# EAGLE design Double (EAGLE 9.5.2)
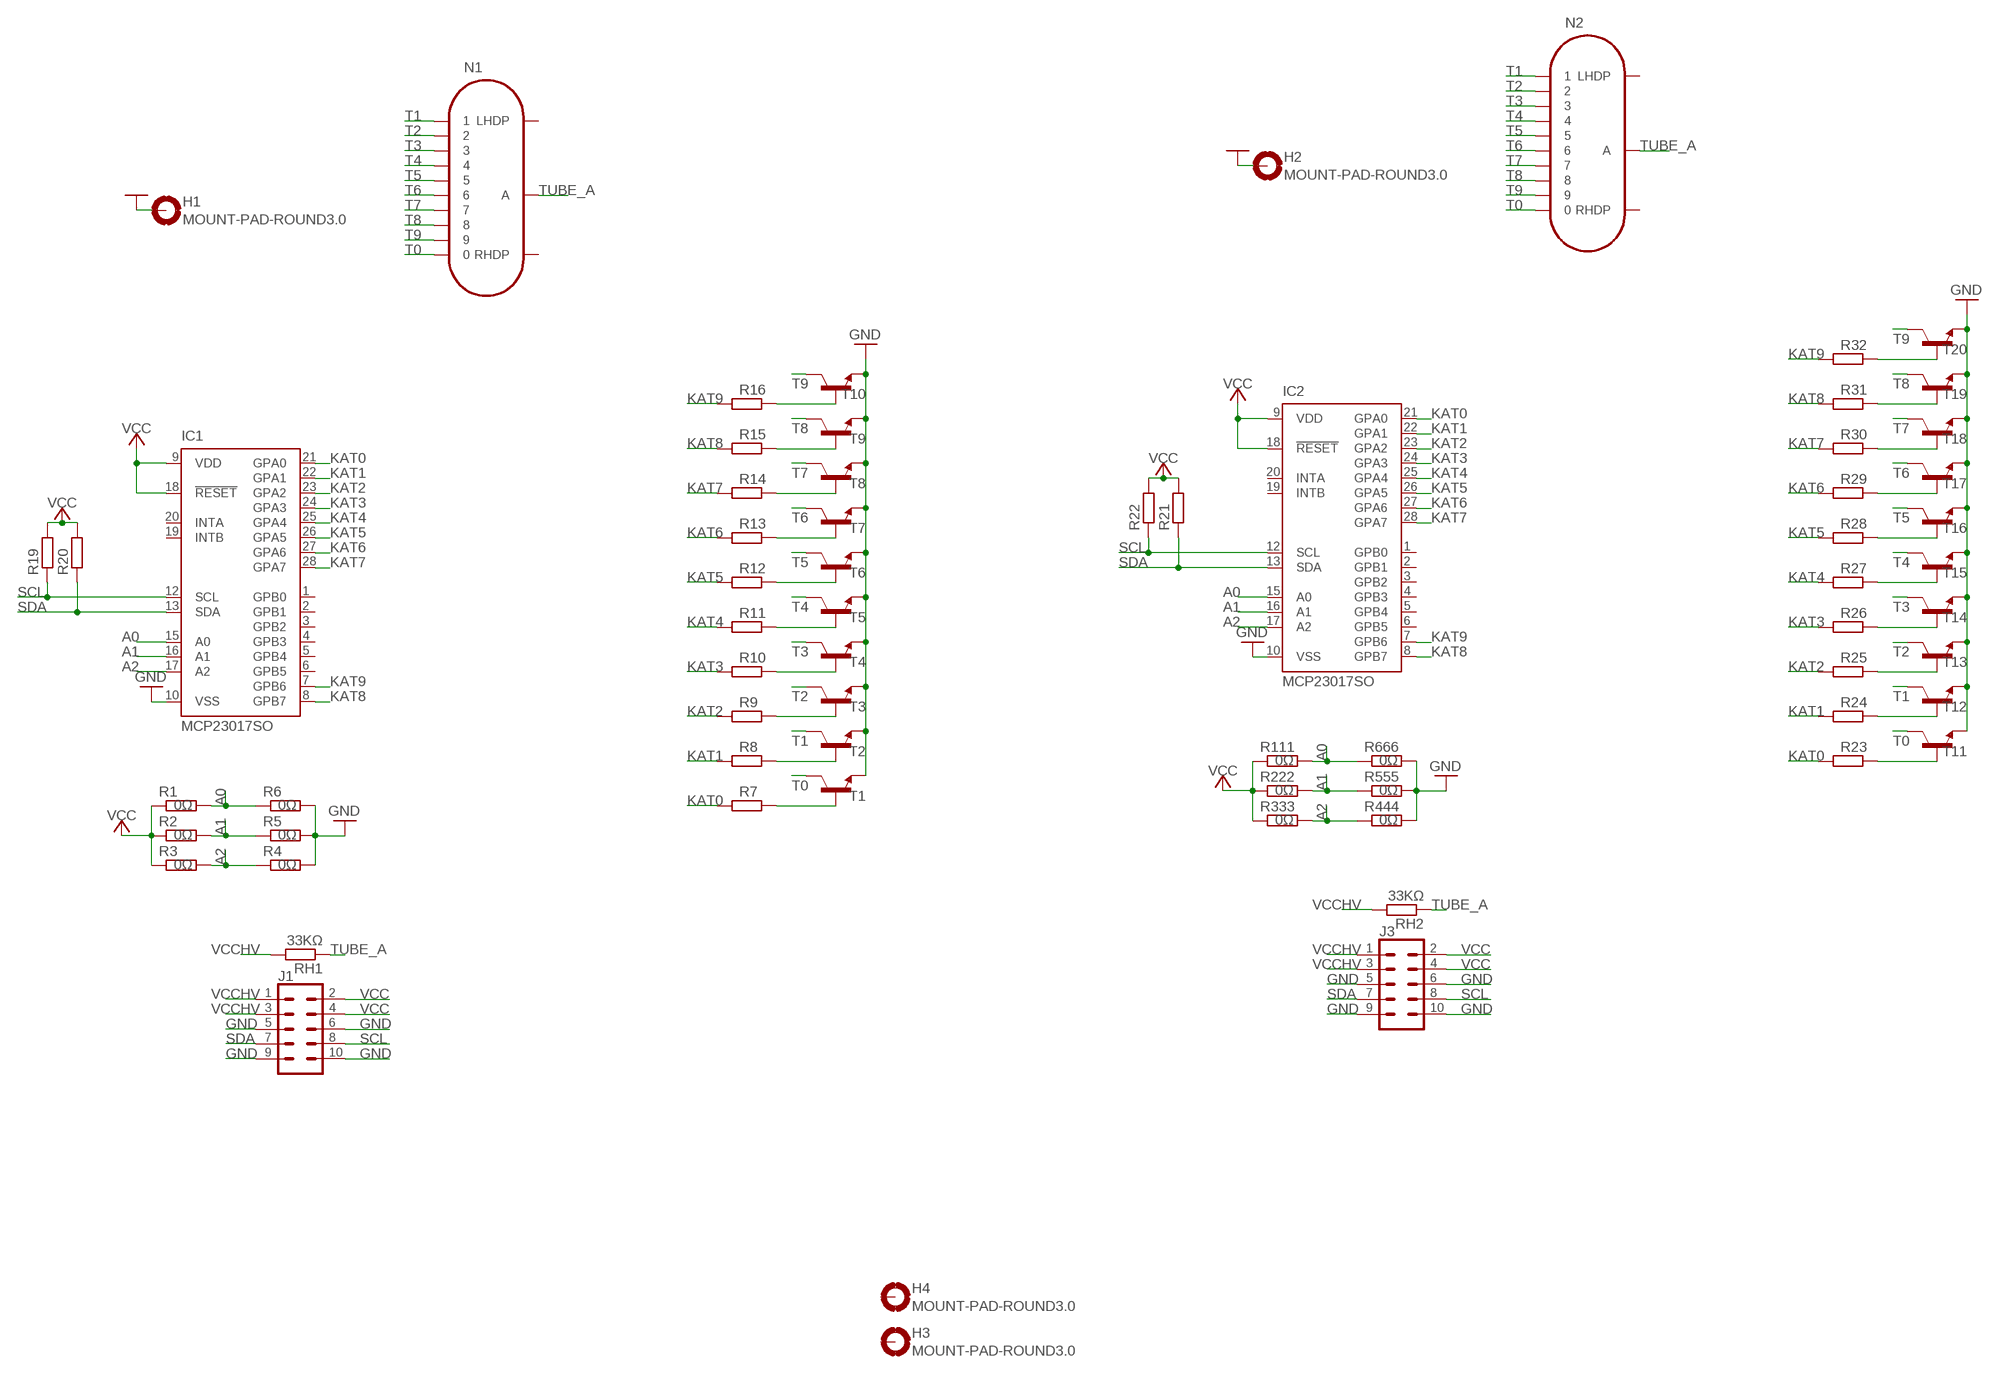
[diagram p0: schematic, sheet 1]

## Parts
H1  MOUNT-PAD-ROUND3.0  [3,0-PAD]
H2  MOUNT-PAD-ROUND3.0  [3,0-PAD]
H3  MOUNT-PAD-ROUND3.0  [3,0-PAD]
H4  MOUNT-PAD-ROUND3.0  [3,0-PAD]
IC1  MCP23017SO  [SO28W]
IC2  MCP23017SO  [SO28W]
J1  CONN_05X2PTH  [2X5]
J3  CONN_05X2PTH  [2X5]
N1  IN-14  [IN-14]
N2  IN-14  [IN-14]
R1  0Ω  R-EU_R1206  [R1206]
R2  0Ω  R-EU_R1206  [R1206]
R3  0Ω  R-EU_R1206  [R1206]
R4  0Ω  R-EU_R1206  [R1206]
R5  0Ω  R-EU_R1206  [R1206]
R6  0Ω  R-EU_R1206  [R1206]
R7  R-EU_R1206  [R1206]
R8  R-EU_R1206  [R1206]
R9  R-EU_R1206  [R1206]
R10  R-EU_R1206  [R1206]
R11  R-EU_R1206  [R1206]
R12  R-EU_R1206  [R1206]
R13  R-EU_R1206  [R1206]
R14  R-EU_R1206  [R1206]
R15  R-EU_R1206  [R1206]
R16  R-EU_R1206  [R1206]
R19  R-EU_R1206  [R1206]
R20  R-EU_R1206  [R1206]
R21  R-EU_R1206  [R1206]
R22  R-EU_R1206  [R1206]
R23  R-EU_R1206  [R1206]
R24  R-EU_R1206  [R1206]
R25  R-EU_R1206  [R1206]
R26  R-EU_R1206  [R1206]
R27  R-EU_R1206  [R1206]
R28  R-EU_R1206  [R1206]
R29  R-EU_R1206  [R1206]
R30  R-EU_R1206  [R1206]
R31  R-EU_R1206  [R1206]
R32  R-EU_R1206  [R1206]
R111  0Ω  R-EU_R1206  [R1206]
R222  0Ω  R-EU_R1206  [R1206]
R333  0Ω  R-EU_R1206  [R1206]
R444  0Ω  R-EU_R1206  [R1206]
R555  0Ω  R-EU_R1206  [R1206]
R666  0Ω  R-EU_R1206  [R1206]
RH1  33KΩ  R-EU_0207/15  [0207/15]
RH2  33KΩ  R-EU_0207/15  [0207/15]
T1  MMBTA42LT1-NPN-SOT23-BEC  [SOT23-BEC]
T2  MMBTA42LT1-NPN-SOT23-BEC  [SOT23-BEC]
T3  MMBTA42LT1-NPN-SOT23-BEC  [SOT23-BEC]
T4  MMBTA42LT1-NPN-SOT23-BEC  [SOT23-BEC]
T5  MMBTA42LT1-NPN-SOT23-BEC  [SOT23-BEC]
T6  MMBTA42LT1-NPN-SOT23-BEC  [SOT23-BEC]
T7  MMBTA42LT1-NPN-SOT23-BEC  [SOT23-BEC]
T8  MMBTA42LT1-NPN-SOT23-BEC  [SOT23-BEC]
T9  MMBTA42LT1-NPN-SOT23-BEC  [SOT23-BEC]
T10  MMBTA42LT1-NPN-SOT23-BEC  [SOT23-BEC]
T11  MMBTA42LT1-NPN-SOT23-BEC  [SOT23-BEC]
T12  MMBTA42LT1-NPN-SOT23-BEC  [SOT23-BEC]
T13  MMBTA42LT1-NPN-SOT23-BEC  [SOT23-BEC]
T14  MMBTA42LT1-NPN-SOT23-BEC  [SOT23-BEC]
T15  MMBTA42LT1-NPN-SOT23-BEC  [SOT23-BEC]
T16  MMBTA42LT1-NPN-SOT23-BEC  [SOT23-BEC]
T17  MMBTA42LT1-NPN-SOT23-BEC  [SOT23-BEC]
T18  MMBTA42LT1-NPN-SOT23-BEC  [SOT23-BEC]
T19  MMBTA42LT1-NPN-SOT23-BEC  [SOT23-BEC]
T20  MMBTA42LT1-NPN-SOT23-BEC  [SOT23-BEC]

## Nets
A0: IC1.15(A0) IC2.15(A0) R1.2 R6.1 R111.2 R666.1
A1: IC1.16(A1) IC2.16(A1) R2.2 R5.1 R222.2 R555.1
A2: IC1.17(A2) IC2.17(A2) R3.2 R4.1 R333.2 R444.1
GND: H1.B3,0(MOUNT) H2.B3,0(MOUNT) IC1.10(VSS) IC2.10(VSS) J1.5 J1.6 J1.9 J1.10 J3.5 J3.6 J3.9 J3.10 R4.2 R5.2 R6.2 R444.2 R555.2 R666.2 T1.E T2.E T3.E T4.E T5.E T6.E T7.E T8.E T9.E T10.E T11.E T12.E T13.E T14.E T15.E T16.E T17.E T18.E T19.E T20.E
KAT0: IC1.21(GPA0) IC2.21(GPA0) R7.1 R23.1
KAT1: IC1.22(GPA1) IC2.22(GPA1) R8.1 R24.1
KAT2: IC1.23(GPA2) IC2.23(GPA2) R9.1 R25.1
KAT3: IC1.24(GPA3) IC2.24(GPA3) R10.1 R26.1
KAT4: IC1.25(GPA4) IC2.25(GPA4) R11.1 R27.1
KAT5: IC1.26(GPA5) IC2.26(GPA5) R12.1 R28.1
KAT6: IC1.27(GPA6) IC2.27(GPA6) R13.1 R29.1
KAT7: IC1.28(GPA7) IC2.28(GPA7) R14.1 R30.1
KAT8: IC1.8(GPB7) IC2.8(GPB7) R15.1 R31.1
KAT9: IC1.7(GPB6) IC2.7(GPB6) R16.1 R32.1
N$2: R7.2 T1.B
N$3: R16.2 T10.B
N$4: R15.2 T9.B
N$5: R14.2 T8.B
N$6: R13.2 T7.B
N$7: R12.2 T6.B
N$8: R11.2 T5.B
N$9: R10.2 T4.B
N$10: R9.2 T3.B
N$11: R8.2 T2.B
N$21: R23.2 T11.B
N$22: R32.2 T20.B
N$23: R31.2 T19.B
N$24: R30.2 T18.B
N$25: R29.2 T17.B
N$26: R28.2 T16.B
N$27: R27.2 T15.B
N$28: R26.2 T14.B
N$29: R25.2 T13.B
N$30: R24.2 T12.B
SCL: IC1.12(SCL) IC2.12(SCL) J1.8 J3.8 R19.1 R22.1
SDA: IC1.13(SDA) IC2.13(SDA) J1.7 J3.7 R20.1 R21.1
T0: N1.0 N2.0 T1.C T11.C
T1: N1.1 N2.1 T2.C T12.C
T2: N1.2 N2.2 T3.C T13.C
T3: N1.3 N2.3 T4.C T14.C
T4: N1.4 N2.4 T5.C T15.C
T5: N1.5 N2.5 T6.C T16.C
T6: N1.6 N2.6 T7.C T17.C
T7: N1.7 N2.7 T8.C T18.C
T8: N1.8 N2.8 T9.C T19.C
T9: N1.9 N2.9 T10.C T20.C
TUBE_A: N1.A N2.A RH1.1 RH2.1
VCC: IC1.9(VDD) IC1.18(!RESET) IC2.9(VDD) IC2.18(!RESET) J1.2 J1.4 J3.2 J3.4 R1.1 R2.1 R3.1 R19.2 R20.2 R21.2 R22.2 R111.1 R222.1 R333.1
VCCHV: J1.1 J1.3 J3.1 J3.3 RH1.2 RH2.2
Unconnected: H3.B3,0(MOUNT) H4.B3,0(MOUNT) IC1.1(GPB0) IC1.2(GPB1) IC1.3(GPB2) IC1.4(GPB3) IC1.5(GPB4) IC1.6(GPB5) IC1.19(INTB) IC1.20(INTA) IC2.1(GPB0) IC2.2(GPB1) IC2.3(GPB2) IC2.4(GPB3) IC2.5(GPB4) IC2.6(GPB5) IC2.19(INTB) IC2.20(INTA) N1.LHDP N1.RHDP N2.LHDP N2.RHDP

## Library data of the parts
H1-H4 = holes:MOUNT-PAD-ROUND: MOUNTING PAD, round
IC1 IC2 = adafruit:MCP23017: http://ww1.microchip.com/downloads/en/DeviceDoc/21952a.pdf Source: http://ww1.microchip.com/downloads/en/DeviceDoc/21952a.pdf
J1 J3 = SparkFun-Connectors:CONN_05X2: Multi connection point. Often used as Generic Header-pin footprint for 0.1 inch spaced/style header connections For AVR SPI programming port, see special device with nice symbol: "AVR_SPI_PROG_5x2.dev" You can populate with any combo of single row headers, but if you'd like an exact match, check these: 2x5 AVR ICSP Male Header <https://www.sparkfun.com/products/778> (PRT-00778) 2x5 Pin Shrouded Header <https://www.sparkfun.com/products/8506> (PRT-08506) On any of the 0.1 inch spaced packages, you can populate with these: Break Away Headers - Straight <https://www.sparkfun.com/products/116> (PRT-00116) Break Away Male Headers - Right Angle <https://www.sparkfun.com/products/553> (PRT-00553) Female Headers <https://www.sparkfun.com/products/115> (PRT-00115) Break Away Headers - Machine Pin <https://www.sparkfun.com/products/117> (PRT-00117) Break Away Female Headers - Swiss Machine Pin <https://www.sparkfun.com/products/743> (PRT-00743) Special note: the shrouded connector mates well with our 5x2 ribbon cables: 2x5 Pin IDC Ribbon Cable <https://www.sparkfun.com/products/8535> (PRT-08535); PROD_ID: CONN-08499; SF_ID: PRT-0778
N1 N2 = russian-nixies:IN-14: IN-14: medium numeric frontview nixie tube
R1-R16 R19-R32 R111 R222 R333 R444 R555 R666 RH1 RH2 = resistor:R-EU_: RESISTOR, European symbol
T1-T20 = transistor:*-NPN-: NPN Transistror BF959 corrected 2008.03.06

## Board
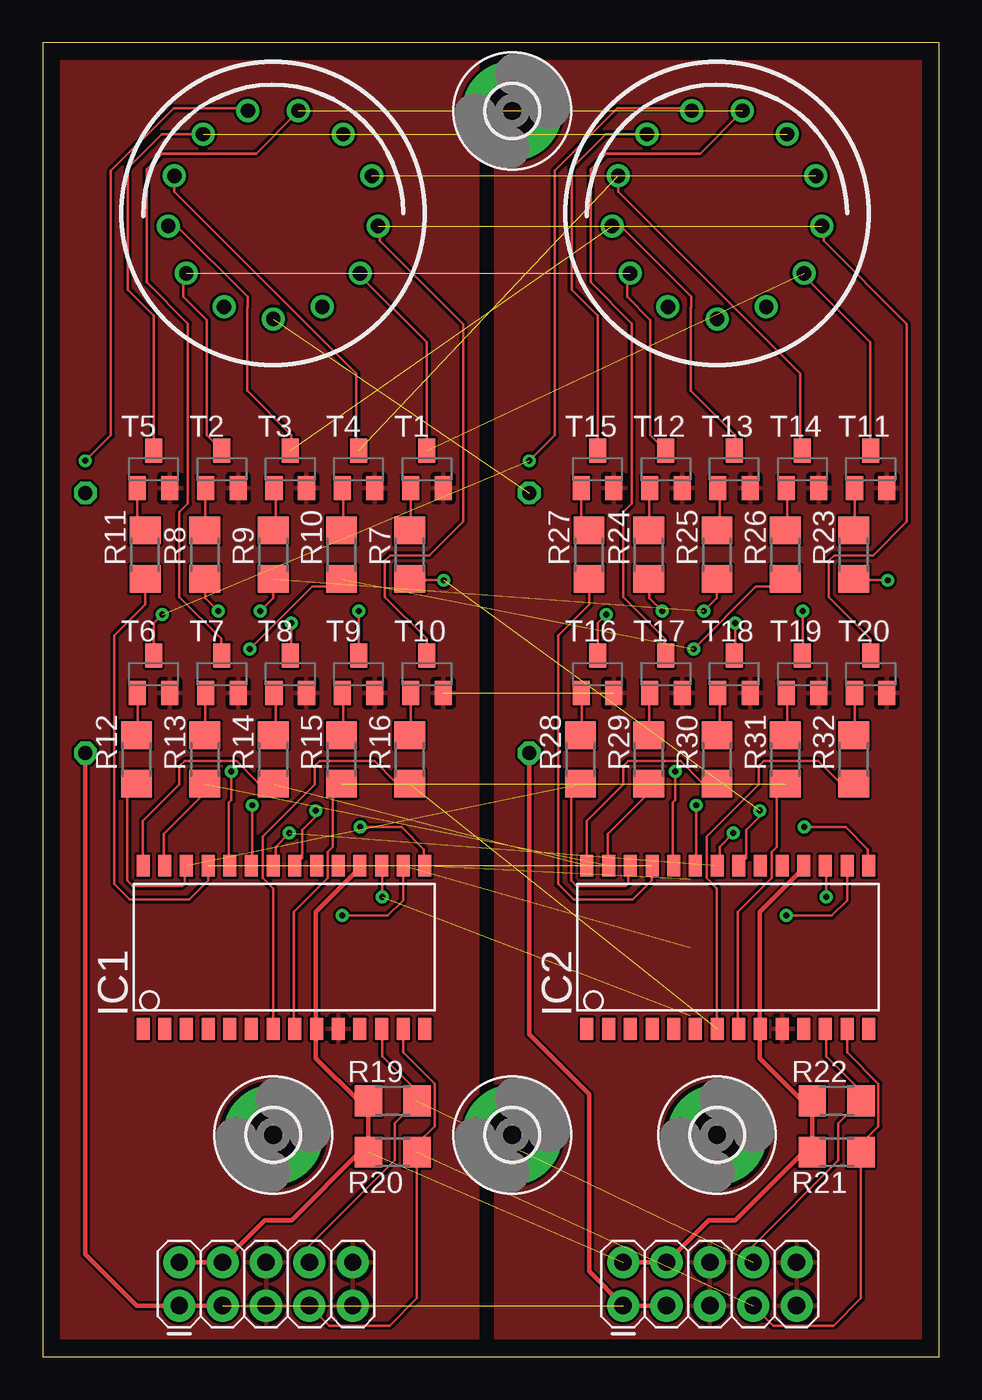
[diagram p1: board, top side]
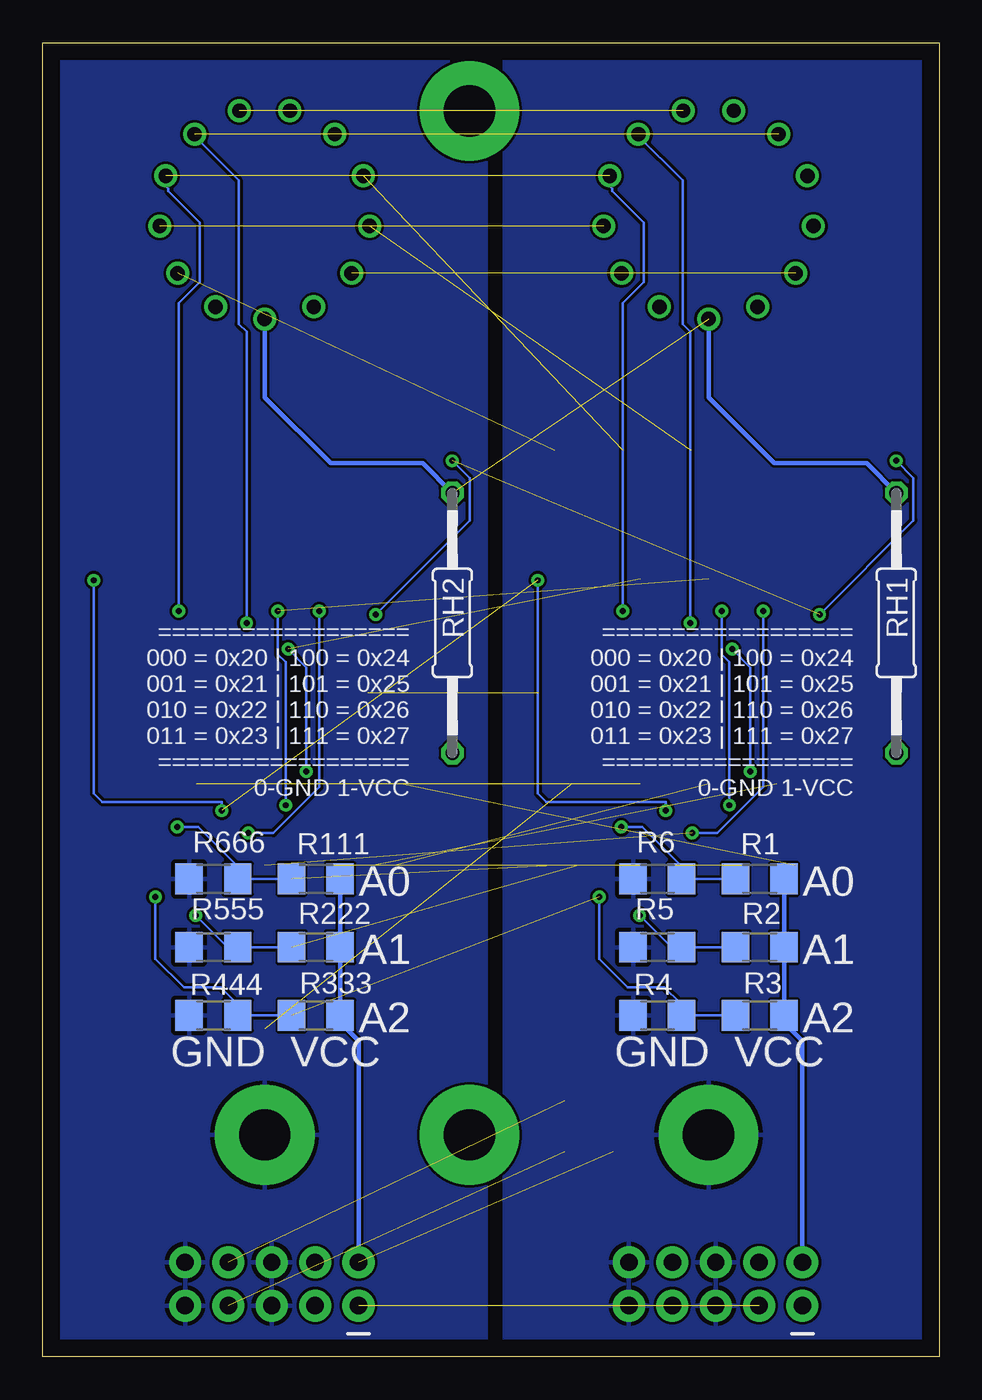
[diagram p2: board, bottom side, seen from below]

Size 52.5 x 77 mm. Coordinates in mm from the lower left corner, seen from the top.
Outline: 0,77 0,0 52.5,0 52.5,77 0,77
Copper layers (1*16): Top 0.035mm / dielectric 1.5mm / Bottom 0.035mm
Design rules "default": minimum track width 6mil, minimum drill 0.35mm, track to track 6mil, track to pad 6mil, pad to pad 6mil, via to via 6mil, smd to smd 6mil, copper to edge 40mil, drill to drill 6mil, minimum pad ring 10mil, minimum via ring 8mil, stop-mask expansion 4mil, vias tented up to drill 0mil, thermal gap 10mil

### Footprints (pad centres in the part's own frame; a part is rotated, then mirrored left to right if it is on the bottom)
3,0-PAD = drill 3 pad 5.842: B3,0 0,0
SO28W = smd 0.762 x 1.27: 1 -7.62,-4.78; 2 -6.35,-4.78; 3 -5.08,-4.78; 4 -3.81,-4.78; 5 -2.54,-4.78; 6 -1.27,-4.78; 7 0,-4.78; 8 1.27,-4.78; 9 2.54,-4.78; 10 3.81,-4.78; 11 5.08,-4.78; 12 6.35,-4.78; 13 7.62,-4.78; 14 8.89,-4.78; 15 8.89,4.78; 16 7.62,4.78; 17 6.35,4.78; 18 5.08,4.78; 19 3.81,4.78; 20 2.54,4.78; 21 1.27,4.78; 22 0,4.78; 23 -1.27,4.78; 24 -2.54,4.78; 25 -3.81,4.78; 26 -5.08,4.78; 27 -6.35,4.78; 28 -7.62,4.78
2X5 = drill 1.016 pad 1.88: 1 0,0; 2 0,2.54; 3 2.54,0; 4 2.54,2.54; 5 5.08,0; 6 5.08,2.54; 7 7.62,0; 8 7.62,2.54; 9 10.16,0; 10 10.16,2.54
IN-14 = drill 0.84: 0 5.094,-3.516; 1 -5.094,-3.516; 2 -6.145,-0.746; 3 -5.788,2.195; 4 -4.105,4.633; 5 -1.481,6.01; 6 1.481,6.01; 7 4.105,4.633; 8 5.788,2.195; 9 6.145,-0.746; A 0,-6.19; LHDP 2.877,-5.481; RHDP -2.877,-5.481
R1206 = smd 1.6 x 1.803: 1 -1.422,0; 2 1.422,0
0207/15 = drill 0.813 octagon: 1 -7.62,0; 2 7.62,0
SOT23-BEC = smd 1 x 1.4: B -0.95,-1.1; C 0,1.1; E 0.95,-1.1

### Placement (x,y rotation side)
H1  13.5,13 0 top
H2  39.5,13 0 top
H3  27.5,73 0 top
H4  27.5,13 0 top
IC1  13.5,24 0 top
IC2  39.5,24 0 top
J1  8,3 0 top
J3  34,3 0 top
N1  13.5,67 0 top
N2  39.5,67 0 top
R1  10.5,28 180 bottom
R2  10.5,24 180 bottom
R3  10.5,20 180 bottom
R4  16.5,20 180 bottom
R5  16.5,24 180 bottom
R6  16.5,28 180 bottom
R7  21.5,47 90 top
R8  9.5,47 90 top
R9  13.5,47 90 top
R10  17.5,47 90 top
R11  6,47 90 top
R12  5.5,35 90 top
R13  9.5,35 90 top
R14  13.5,35 90 top
R15  17.5,35 90 top
R16  21.5,35 90 top
R19  20.5,15 180 top
R20  20.5,12 180 top
R21  46.5,12 180 top
R22  46.5,15 180 top
R23  47.5,47 90 top
R24  35.5,47 90 top
R25  39.5,47 90 top
R26  43.5,47 90 top
R27  32,47 90 top
R28  31.5,35 90 top
R29  35.5,35 90 top
R30  39.5,35 90 top
R31  43.5,35 90 top
R32  47.5,35 90 top
R111  36.5,28 180 bottom
R222  36.5,24 180 bottom
R333  36.5,20 180 bottom
R444  42.5,20 180 bottom
R555  42.5,24 180 bottom
R666  42.5,28 180 bottom
RH1  2.5,43 270 bottom
RH2  28.5,43 270 bottom
T1  22.5,52 0 top
T2  10.5,52 0 top
T3  14.5,52 0 top
T4  18.5,52 0 top
T5  6.5,52 0 top
T6  6.5,40 0 top
T7  10.5,40 0 top
T8  14.5,40 0 top
T9  18.5,40 0 top
T10  22.5,40 0 top
T11  48.5,52 0 top
T12  36.5,52 0 top
T13  40.5,52 0 top
T14  44.5,52 0 top
T15  32.5,52 0 top
T16  32.5,40 0 top
T17  36.5,40 0 top
T18  40.5,40 0 top
T19  44.5,40 0 top
T20  48.5,40 0 top

### Tracks (layer width: path | path; a pad name or v marks a point on that pad's centre or on a via)
A0  (via drill 0.35)  (1 unrouted)
  Top 0.152: v18.61,31.03 21.03,31.03 22.33,29.73 22.33,28.82 IC1.15 | v44.61,31.03 47.03,31.03 48.33,29.73 48.33,28.82 IC2.15
  Bottom 0.152: R1.2 R6.1 15.17,28.05 15.17,28.82 17.39,31.03 v18.61,31.03 | R111.2 R666.1 41.17,28.05 41.17,28.82 43.39,31.03 v44.61,31.03
A1  (via drill 0.35)  (1 unrouted)
  Top 0.152: v17.54,25.85 20.22,25.85 21.11,26.75 21.11,28.66 IC1.16 | v43.54,25.85 46.22,25.85 47.11,26.75 47.11,28.66 IC2.16
  Bottom 0.152: 11.97,24 R5.1 15.17,24.09 15.78,24.09 v17.54,25.85 | 11.97,24 R2.2 11.97,23.94 11.97,24 | 37.97,24 R555.1 41.17,24.09 41.78,24.09 v43.54,25.85 | 37.97,24 R222.2 37.97,23.94 37.97,24
A2  (via drill 0.35)  (1 unrouted)
  Top 0.152: v19.89,26.94 19.89,28.66 IC1.17 | v45.89,26.94 45.89,28.66 IC2.17
  Bottom 0.152: R3.2 R4.1 15.17,20.13 15.17,20.74 16.08,21.65 18.22,21.65 19.89,23.33 v19.89,26.94 | R333.2 R444.1 41.17,20.13 41.17,20.74 42.08,21.65 44.22,21.65 45.89,23.33 v45.89,26.94
GND  (1 unrouted)
  Top 0.152: 19.89,50.91 19.59,50.91 | 45.89,50.91 45.59,50.91
  pour Bottom: 0,77 0,0 25.5,0 25.5,77
  pour Top: 0,77 0,0 25.5,0 25.5,77
  pour Bottom: 26.5,77 26.5,0 52.5,0 52.5,77
  pour Top: 26.5,77 26.5,0 52.5,0 52.5,77
KAT0  (via drill 0.35)  (1 unrouted)
  Top 0.152: IC1.21 15.21,29.22 15.21,30.86 16,31.65 v16,32 | v23.5,45.5 21.58,45.5 R7.1 | IC2.21 41.21,29.22 41.21,30.86 42,31.65 v42,32 | v49.5,45.5 47.58,45.5 R23.1
  Bottom 0.152: v23.5,45.5 23.5,33 23,32.5 16,32.5 v16,32 | v49.5,45.5 49.5,33 49,32.5 42,32.5 v42,32
KAT1  (via drill 0.35)  (1 unrouted)
  Top 0.152: v14.45,30.69 13.65,29.88 13.65,28.82 IC1.22 | v10.29,43.71 9.53,44.47 9.53,45.43 R8.1 | v40.45,30.69 39.65,29.88 39.65,28.82 IC2.22 | v36.29,43.71 35.53,44.47 35.53,45.43 R24.1
  Bottom 0.152: v14.45,30.69 12.99,30.69 10.29,33.39 v10.29,43.71 | v40.45,30.69 38.99,30.69 36.29,33.39 v36.29,43.71
KAT2  (via drill 0.35)  (1 unrouted)
  Top 0.152: v12.27,32.32 12.27,28.82 IC1.23 | v12.73,43.71 13.49,44.47 13.49,45.43 R9.1 | v38.27,32.32 38.27,28.82 IC2.23 | v38.73,43.71 39.49,44.47 39.49,45.43 R25.1
  Bottom 0.152: v12.27,32.32 12.27,40.7 12.73,41.16 v12.73,43.71 | v38.27,32.32 38.27,40.7 38.73,41.16 v38.73,43.71
KAT3  (via drill 0.35)  (1 unrouted)
  Top 0.152: v11.05,34.3 11.05,32.63 10.9,32.47 10.9,28.82 IC1.24 | v12.12,41.47 15.78,45.12 17.15,45.12 17.46,45.43 R10.1 | v37.05,34.3 37.05,32.63 36.9,32.47 36.9,28.82 IC2.24 | v38.12,41.47 41.78,45.12 43.15,45.12 43.46,45.43 R26.1
  Bottom 0.152: v11.05,34.3 11.05,40.4 v12.12,41.47 | v37.05,34.3 37.05,40.4 v38.12,41.47
KAT4  (1 unrouted)
  Top 0.152: R11.1 6,44.08 4.2,42.28 4.2,27.71 5.11,26.79 8.57,26.79 9.68,27.9 9.68,28.66 IC1.25 | R27.1 32,44.08 30.2,42.28 30.2,27.71 31.11,26.79 34.57,26.79 35.68,27.9 35.68,28.66 IC2.25
KAT5  (1 unrouted)
  Top 0.152: IC1.26 8.31,28.66 8.31,27.75 8.16,27.6 5.26,27.6 4.96,27.9 4.96,33.08 5.42,33.54 R12.1 | IC2.26 34.31,28.66 34.31,27.75 34.16,27.6 31.26,27.6 30.96,27.9 30.96,33.08 31.42,33.54 R28.1
KAT6  (1 unrouted)
  Top 0.152: IC1.27 7.09,28.82 7.09,30.65 9.38,32.93 9.38,33.54 R13.1 | IC2.27 33.09,28.82 33.09,30.65 35.38,32.93 35.38,33.54 R29.1
KAT7  (1 unrouted)
  Top 0.152: IC1.28 5.87,28.82 5.87,31.41 8.01,33.54 8.01,34.61 8.31,34.91 11.36,34.91 12.58,33.69 13.49,33.69 R14.1 | IC2.28 31.87,28.82 31.87,31.41 34.01,33.54 34.01,34.61 34.31,34.91 37.36,34.91 38.58,33.69 39.49,33.69 R30.1
KAT8  (1 unrouted)
  Top 0.152: IC1.8 14.71,19.37 14.71,26.07 16.69,28.05 16.69,29.58 17,29.88 17,33.08 17.46,33.54 R15.1 | IC2.8 40.71,19.37 40.71,26.07 42.69,28.05 42.69,29.58 43,29.88 43,33.08 43.46,33.54 R31.1
KAT9  (1 unrouted)
  Top 0.152: IC1.7 13.49,19.37 13.49,27.44 12.88,28.05 12.88,30.49 15.93,33.54 15.93,34.61 16.24,34.91 19.44,34.91 20.66,33.69 21.42,33.69 R16.1 | IC2.7 39.49,19.37 39.49,27.44 38.88,28.05 38.88,30.49 41.93,33.54 41.93,34.61 42.24,34.91 45.44,34.91 46.66,33.69 47.42,33.69 R32.1
N$2
  Top 0.152: T1.B 21.57,50.76 21.57,48.48 R7.2
N$3
  Top 0.152: T10.B 21.57,38.87 21.57,36.44 R16.2
N$4
  Top 0.152: T9.B 17.61,38.87 17.61,36.44 R15.2
N$5
  Top 0.152: T8.B 13.65,38.87 13.65,36.44 R14.2
N$6
  Top 0.152: T7.B 9.53,38.87 9.53,36.44 R13.2
N$7
  Top 0.152: T6.B 5.57,38.87 5.57,36.44 R12.2
N$8
  Top 0.152: T5.B 5.55,48.56 R11.2
N$9
  Top 0.152: T4.B 17.61,50.76 17.61,48.48 R10.2
N$10
  Top 0.152: T3.B 13.65,50.76 13.65,48.48 R9.2
N$11
  Top 0.152: T2.B 9.53,50.76 9.53,48.48 R8.2
N$21
  Top 0.152: T11.B 47.57,50.76 47.57,48.48 R23.2
N$22
  Top 0.152: T20.B 47.57,38.87 47.57,36.44 R32.2
N$23
  Top 0.152: T19.B 43.61,38.87 43.61,36.44 R31.2
N$24
  Top 0.152: T18.B 39.65,38.87 39.65,36.44 R30.2
N$25
  Top 0.152: T17.B 35.53,38.87 35.53,36.44 R29.2
N$26
  Top 0.152: T16.B 31.57,38.87 31.57,36.44 R28.2
N$27
  Top 0.152: T15.B 31.55,48.56 R27.2
N$28
  Top 0.152: T14.B 43.61,50.76 43.61,48.48 R26.2
N$29
  Top 0.152: T13.B 39.65,50.76 39.65,48.48 R25.2
N$30
  Top 0.152: T12.B 35.53,50.76 35.53,48.48 R24.2
SCL  (1 unrouted)
  Top 0.152: IC1.12 19.89,19.22 19.89,17.61 21.92,15.58 R19.1 20.61,13.69 20.61,11.5 15.62,6.52 J1.8 | IC2.12 45.89,19.22 45.89,17.61 47.92,15.58 R22.1 46.61,13.69 46.61,11.5 41.62,6.52 J3.8
SDA  (1 unrouted)
  Top 0.152: J1.7 16.79,1.83 20.33,1.83 21.92,3.42 R20.1 21.92,12.48 22.95,13.5 22.95,16 21.12,17.83 IC1.13 | J3.7 42.79,1.83 46.33,1.83 47.92,3.42 R21.1 47.92,12.48 48.95,13.5 48.95,16 47.12,17.83 IC2.13
T0  (1 unrouted)
  Top 0.152: T1.C 22.48,53.2 22.48,59.45 18.52,63.41 N1.0 | T11.C 48.48,53.2 48.48,59.45 44.52,63.41 N2.0
T1  (1 unrouted)
  Top 0.152: T2.C 9.6,54 9.6,60.75 8.23,62.12 8.23,63.3 N1.1 | T12.C 35.6,54 35.6,60.75 34.23,62.12 34.23,63.3 N2.1
T2  (1 unrouted)
  Top 0.152: T3.C 14.56,53.2 14.56,54.01 11.97,56.6 11.97,61.47 12,61.5 12,62.11 7.86,66.25 N1.2 | T13.C 40.56,53.2 40.56,54.01 37.97,56.6 37.97,61.47 38,61.5 38,62.11 33.85,66.25 N2.2
T3  (1 unrouted)
  Top 0.152: T4.C 18.37,53.2 18.37,57.61 7.71,68.27 N1.3 | T14.C 44.37,53.2 44.37,57.61 33.71,68.27 N2.3
T4  (1 unrouted)
  Top 0.152: N1.4 6.98,71.63 4.98,69.64 4.98,62.52 6.5,61 T5.C | N2.4 32.98,71.63 30.98,69.64 30.98,62.52 32.5,61 T15.C
T5  (via drill 0.35)  (1 unrouted)
  Top 0.152: N1.5 11.97,73.01 11.82,73.16 7.66,73.16 4,69.5 4,54 v2.5,52.5 | T6.C 6.5,43 v7,43.5 | N2.5 37.97,73.01 37.82,73.16 33.66,73.16 30,69.5 30,54 v28.5,52.5 | T16.C 32.5,43 v33,43.5
  Bottom 0.152: v7,43.5 1.5,49 1.5,51.5 v2.5,52.5 | v33,43.5 27.5,49 27.5,51.5 v28.5,52.5
T6  (1 unrouted)
  Top 0.152: T7.C 10.45,41.16 10.45,42.08 8,44.52 8,49.5 8.5,50 8.5,60.55 6.09,62.95 6.09,69.59 7,70.5 12.51,70.5 14.86,72.86 N1.6 | T17.C 36.45,41.16 36.45,42.08 34,44.52 34,49.5 34.5,50 34.5,60.55 32.09,62.95 32.09,69.59 33,70.5 38.51,70.5 40.87,72.86 N2.6
T7  (via drill 0.35)  (1 unrouted)
  Top 0.152: v14.56,42.99 14.56,41.16 T8.C | v40.56,42.99 40.56,41.16 T18.C
  Bottom 0.152: v14.56,42.99 14.56,60.06 15.02,60.52 15.02,68.94 17.61,71.53 N1.7 | v40.56,42.99 40.56,60.06 41.02,60.52 41.02,68.94 43.61,71.53 N2.7
T8  (via drill 0.35)  (1 unrouted)
  Top 0.152: v18.52,43.71 18.52,41.16 T9.C | v44.52,43.71 44.52,41.16 T19.C
  Bottom 0.152: v18.52,43.71 18.52,61.73 17.3,62.95 17.3,66.46 19.13,68.29 19.13,68.44 19.29,68.59 19.29,69.05 N1.8 | v44.52,43.71 44.52,61.73 43.3,62.95 43.3,66.46 45.13,68.29 45.13,68.44 45.28,68.59 45.28,69.05 N2.8
T9  (1 unrouted)
  Top 0.152: T10.C 22.48,41.16 22.48,42.08 20.05,44.51 20.05,46.65 20.35,46.95 22.64,46.95 24.62,48.93 24.62,60.52 19.74,65.39 19.74,66.15 N1.9 | T20.C 48.48,41.16 48.48,42.08 46.05,44.51 46.05,46.65 46.35,46.95 48.64,46.95 50.62,48.93 50.62,60.52 45.74,65.39 45.74,66.15 N2.9
TUBE_A  (1 unrouted)
  Bottom 0.152: 13.49,60.67 N1.A | 39.49,60.67 N2.A
  Bottom 0.254: 13.49,60.67 13.49,56.21 9.64,52.36 4.24,52.36 RH1.1 | 39.49,60.67 39.49,56.21 35.64,52.36 30.24,52.36 RH2.1
VCC  (1 unrouted)
  Top 0.152: 16.08,19.22 IC1.9 | 42.08,19.22 IC2.9
  Top 0.254: J1.2 J1.4 13,8 14.58,8 18.58,12 R20.2 R19.2 18.5,15 16,17.5 16,19.13 16.08,19.22 16,19.3 16,26.06 18.58,28.64 IC1.18 | J3.2 J3.4 39,8 40.58,8 44.58,12 R21.2 R22.2 44.5,15 42,17.5 42,19.13 42.08,19.22 42,19.3 42,26.06 44.58,28.64 IC2.18
  Bottom 0.152: R3.1 9.29,19.79 | R333.1 35.29,19.79
  Bottom 0.254: R3.1 R2.1 R1.1 | J1.2 8,18.5 9.29,19.79 | R333.1 R222.1 R111.1 | J3.2 34,18.5 35.29,19.79
VCCHV  (1 unrouted)
  Top 0.254: J1.3 J1.1 5.5,3 2.5,6 RH1.2 | J3.3 J3.1 32,5 32,15.38 28.5,18.88 RH2.2

### Text on the board
bPlace: ================== / 000 = 0x20 | 100 = 0x24 / 001 = 0x21 | 101 = 0x25 / 010 = 0x22 | 110 = 0x26 / 011 = 0x23 | 111 = 0x27 / ================== / 0-GND 1-VCC | ================== / 000 = 0x20 | 100 = 0x24 / 001 = 0x21 | 101 = 0x25 / 010 = 0x22 | 110 = 0x26 / 011 = 0x23 | 111 = 0x27 / ================== / 0-GND 1-VCC | A0 | A0 | A1 | A1 | A2 | A2 | VCC | GND | VCC | GND